# EasyEDA Pro project ProPrj_Solar MPPT Charger_2024-10-06.epro

# Schematic Solar Converter
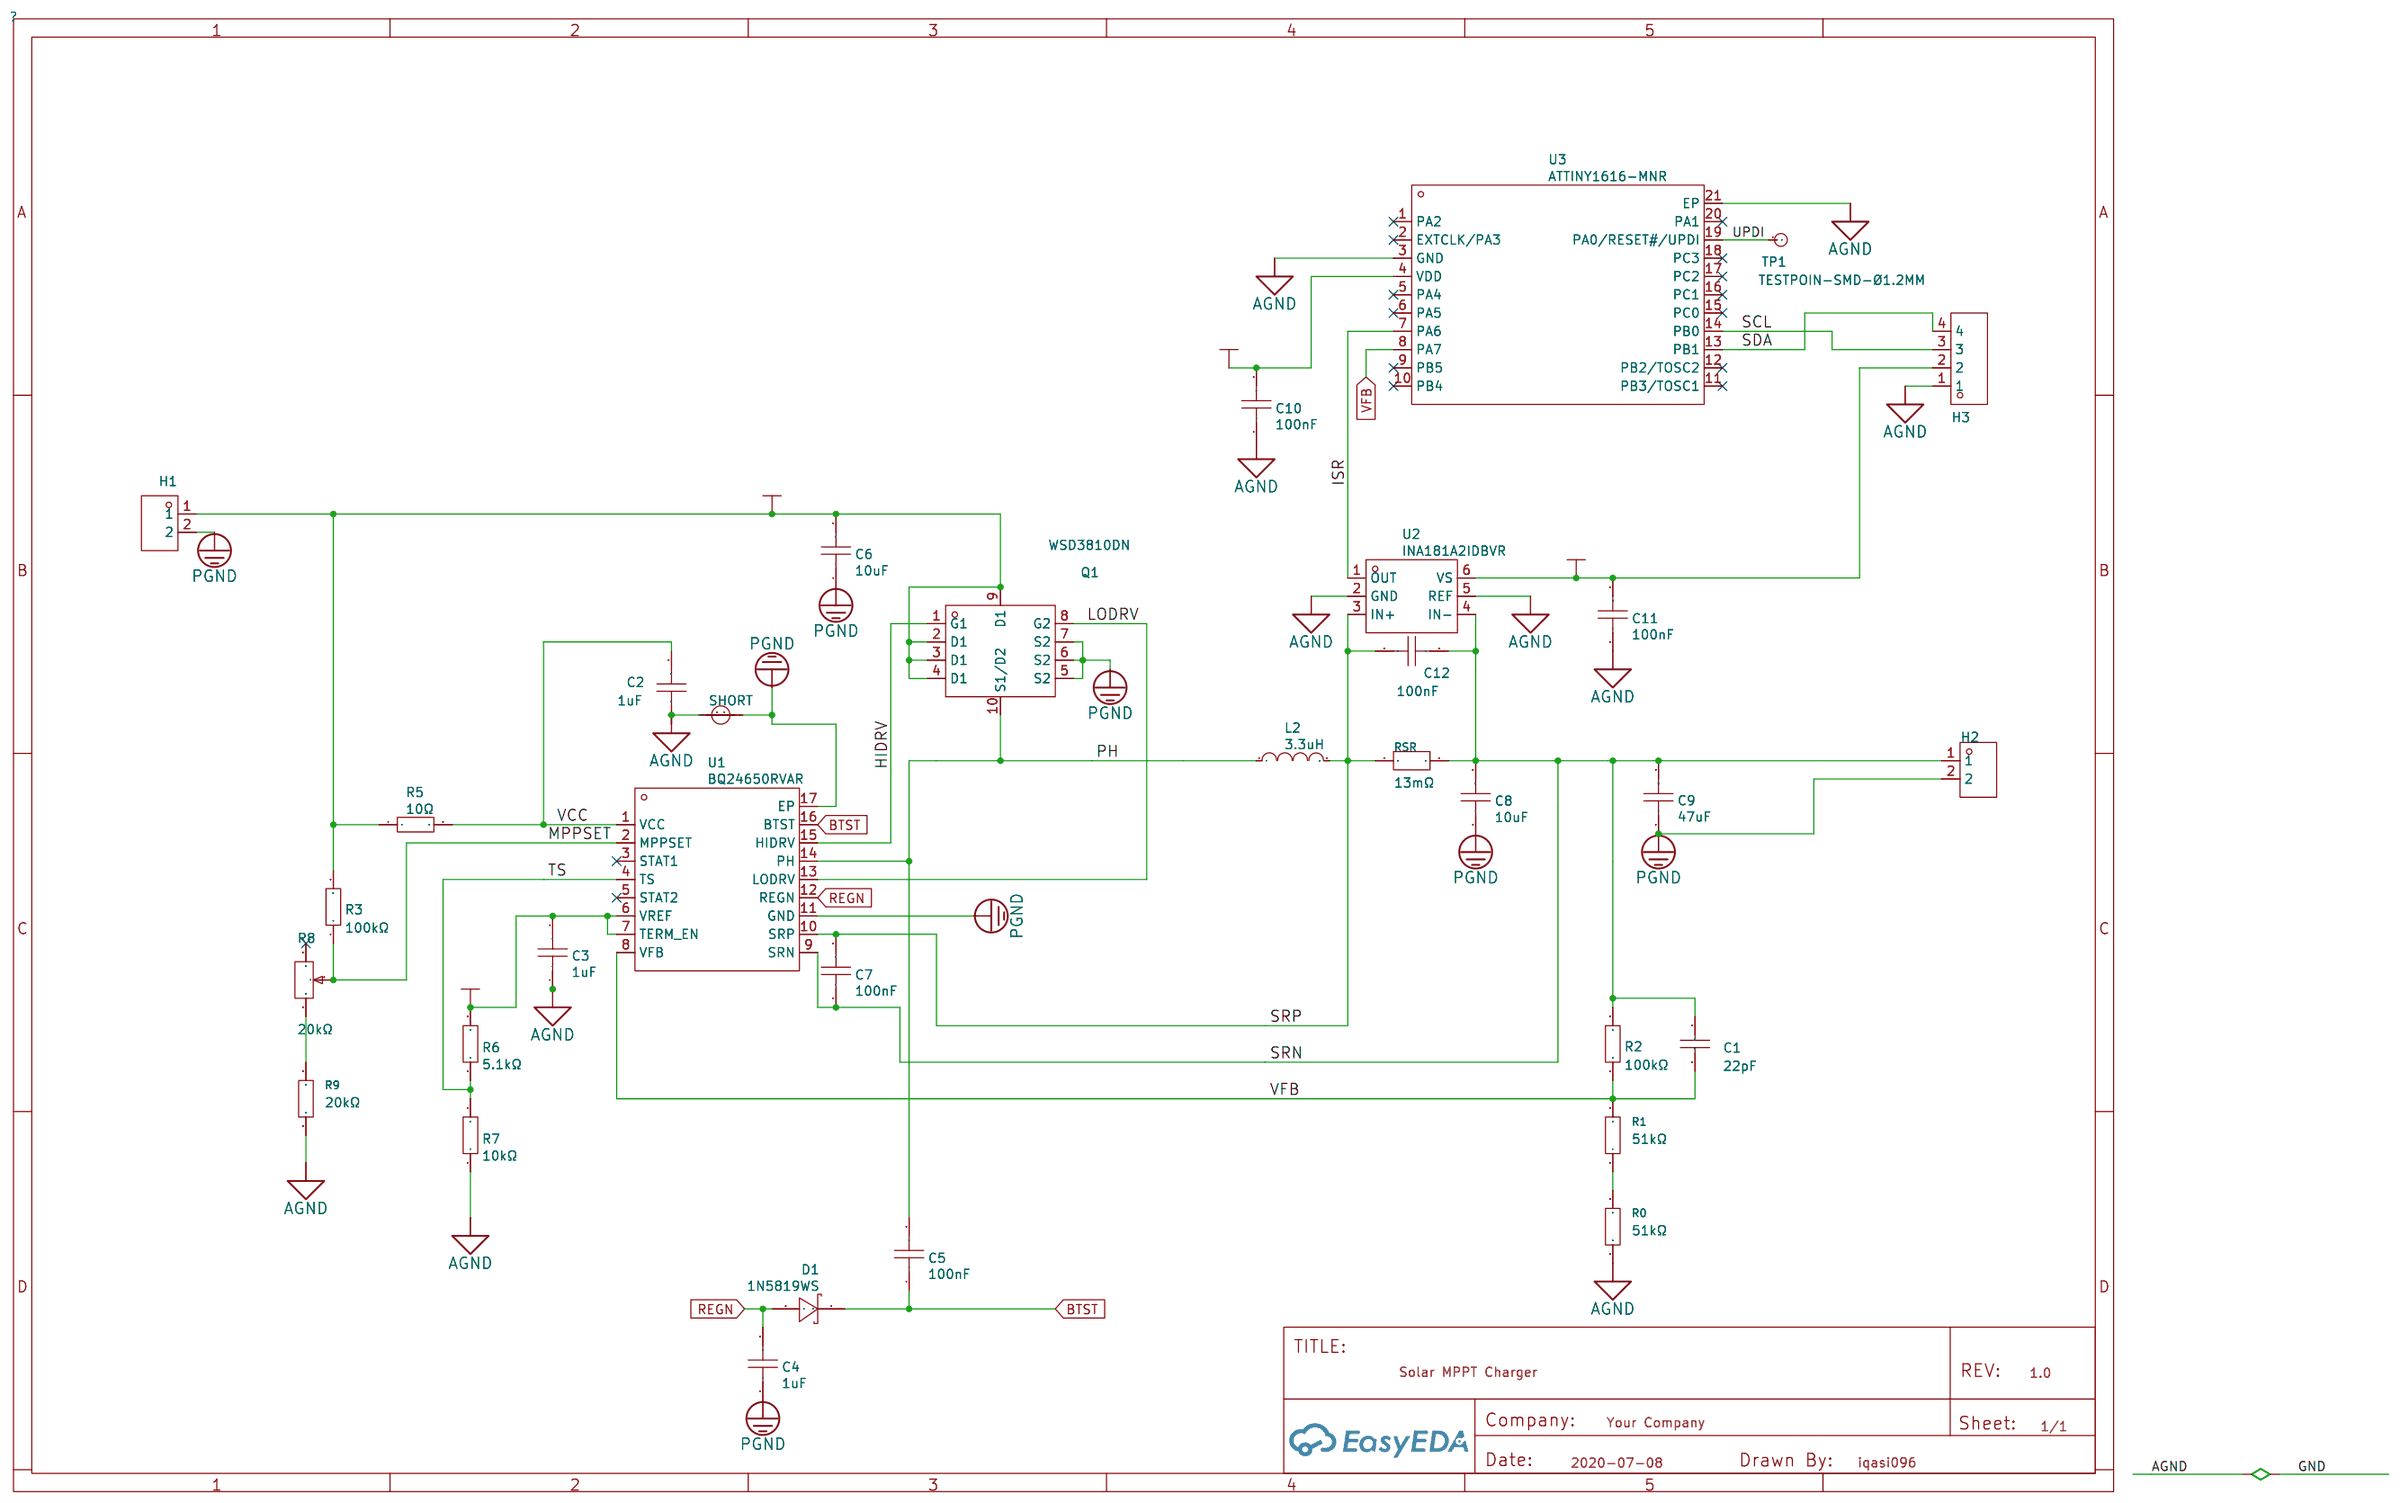
[diagram p0: schematic sheet]

## Parts
C1  22pF  [C0402]
C2  1uF  [C0402]
C3  1uF  [C0402]
C4  1uF  [C0402]
C5  100nF  [C0402]
C6  10uF  [C0603]
C7  100nF  [C0402]
C8  10uF  [C0603]
C9  47uF  [C1206]
C10  100nF  [C0402]
C11  100nF  [C0402]
C12  100nF  [C0402]
D1  1N5819WS  [SOD-323_L1.8-W1.3-LS2.5-RD]
H1  SIP2-2.54MM双排针  [footprint_31f8]
H2  SIP2-2.54MM双排针  [footprint_31f8]
H3  22284040  [footprint_b63e]
L2  3.3uH  [IND-SMD_L7.1-W6.6]
Q1  WSD3810DN  [DFN-8_L3.0-W3.0-P0.65-BL_WSD3810DN]
R0  51kΩ  [R0402]
R1  51kΩ  [R0402]
R2  100kΩ  [R0402]
R3  100kΩ  [R0402]
R5  10Ω  [R0402]
R6  5.1kΩ  [R0402]
R7  10kΩ  [R0402]
R8  20kΩ  [RES-ADJ-SMD_3P-L3.8-W3.0-P2.00-BL-FS]
R9  20kΩ  [R0402]
RSR  13mΩ  [R0805]
SHORT  -  [short_keith]  (no BOM)
TP1  TESTPOIN-SMD-Ø1.2MM  [footprint_b741]
U1  BQ24650RVAR  [footprint_acdf]
U2  INA181A2IDBVR  [SOT-23-6_L2.9-W1.6-P0.95-LS2.8-BL]
U3  ATTINY1616-MNR  [footprint_6c4b]

## Library data of the parts
C1 = 0402CG220J500NT: Capacitance: Tolerance:±5% Tolerance:±5% Voltage Rated: Temperature Coefficient:; LCSC Part Name: 22pF ±5% 50V; Supplier Part: C1555; Manufacturer: FH(风华); Supplier Footprint: 0402; JLCPCB Part Class: Basic Part; Datasheet: https://atta.szlcsc.com/upload/public/pdf/source/20200305/C486355_26A10D38EF8C2A5C37091D0039909270.pdf; Supplier: LCSC; Tolerance: ±5%
C2-C4 = CL05A105KA5NQNC: Capacitance: Tolerance:±10% Tolerance:±10% Voltage Rated: Temperature Coefficient:; LCSC Part Name: 1uF ±10% 25V; Supplier Part: C52923; Manufacturer: SAMSUNG(三星); Supplier Footprint: 0402; JLCPCB Part Class: Basic Part; Datasheet: https://atta.szlcsc.com/upload/public/pdf/source/20160218/1457707763339.pdf; Supplier: LCSC; Tolerance: ±10%
C5 C7 C10-C12 = CL05B104KB54PNC: Capacitance: Tolerance:±10% Tolerance:±10% Voltage Rated: Temperature Coefficient:; LCSC Part Name: 100nF ±10% 50V; Supplier Part: C307331; Manufacturer: SAMSUNG(三星); Supplier Footprint: 0402; JLCPCB Part Class: Basic Part; Datasheet: https://atta.szlcsc.com/upload/public/pdf/source/20160218/1457707763339.pdf; Supplier: LCSC; Tolerance: ±10%
C6 C8 = CL10A106MA8NRNC: Capacitance: Tolerance:±20% Tolerance:±20% Voltage Rated: Temperature Coefficient:; LCSC Part Name: 10uF ±20% 25V; Supplier Part: C96446; Manufacturer: SAMSUNG(三星); Supplier Footprint: 0603; JLCPCB Part Class: Basic Part; Datasheet: https://atta.szlcsc.com/upload/public/pdf/source/20160218/1457707763339.pdf; Supplier: LCSC; Tolerance: ±20%
C9 = CL31A476MPHNNNE: Capacitance: Tolerance:±20% Tolerance:±20% Voltage Rated: Temperature Coefficient:; LCSC Part Name: 47uF ±20% 10V; Supplier Part: C96123; Manufacturer: SAMSUNG(三星); Supplier Footprint: 1206; JLCPCB Part Class: Basic Part; Datasheet: https://atta.szlcsc.com/upload/public/pdf/source/20160218/1457707763339.pdf; Supplier: LCSC; Tolerance: ±20%
D1 = 1N5819WS_C191023: Forward Voltage (Vf@If):600mV@1A Reverse Voltage (Vr):40V Average Rectified Current (Io):1A; LCSC Part Name: 电压:40V 电流:1A; Supplier Part: C191023; Manufacturer: Hottech(合科泰); Supplier Footprint: SOD-323; JLCPCB Part Class: Basic Part; Datasheet: https://atta.szlcsc.com/upload/public/pdf/source/20220428/3CB86FD8D28D653594B4E35F9D5AEFD9.pdf; Supplier: LCSC; Forward Voltage (Vf@If): 600mV@1A; Reverse Voltage (Vr): 40V; Average Rectified Current (Io): 1A
H1 H2 = SIP2-2.54MM双排针: Supplier: LCSC; Supplier Part: C9900003705; Manufacturer: null; Manufacturer Part: SIP2-2.54mm双排针; JLCPCB Part Class: Extended Part
H3 = 22284040: Supplier: LCSC; Supplier Part: C587039; Manufacturer: MOLEX; JLCPCB Part Class: Extended Part
L2 = CMLO0650H3R3MTT: Inductance: Tolerance:±20% Tolerance:±20% Rated Current: DC Resistance (DCR): Type:屏蔽电感; LCSC Part Name: 3.3uH ±20%; Supplier Part: C439008; Manufacturer: Cybermax(思博科技); Supplier Footprint: SMD,7.1x6.6mm; JLCPCB Part Class: Extended Part; Datasheet: https://atta.szlcsc.com/upload/public/pdf/source/20191016/C439014_8EB8B87E5A293C2FB057F0008DFF1D19.pdf; Supplier: LCSC; Tolerance: ±20%; Type: 屏蔽电感
Q1 = WSD3810DN: Type:2 N-Channel Drain Source Voltage (Vdss): Continuous Drain Current (Id): Power Dissipation (Pd): Drain Source On Resistance (RDS(on)@Vgs,Id):9mΩ@10V,10A Gate Threshold Voltage (Vgs(th)@Id):1.6V@250uA Total Gate Charge (Qg@Vgs):8nC@10V Input Capacitanc; LCSC Part Name: 2个N沟道 耐压:30V 电流:18A; Supplier Part: C2758409; Manufacturer: WINSOK(微硕); Supplier Footprint: DFN-8(3x3); JLCPCB Part Class: Extended Part; Datasheet: https://atta.szlcsc.com/upload/public/pdf/source/20210312/C2758409_38394AEA5B26017FED03245C33F41575.pdf; Supplier: LCSC; Type: 2 N-Channel; Drain Source On Resistance (RDS(on)@Vgs,Id): 9mΩ@10V,10A; Gate Threshold Voltage (Vgs(th)@Id): 1.6V@250uA; Total Gate Charge (Qg@Vgs): 8nC@10V; Input Capacitance (Ciss@Vds): 455pF@15V; Reverse Transfer Capacitance (Crss@Vds): 22pF@15V; Operating Temperature: -55℃~+150℃@(Tj)
R0 R1 = 0402WGF5102TCE: Type:Thick Film Resistors Resistance:51kΩ Tolerance:±1% Tolerance:±1% Power(Watts): Overload Voltage (Max): Temperature Coefficient:±100ppm/℃ Temperature Coefficient:±100ppm/℃ Operating Temperature Range:-55℃~+155℃ Operating Temperature Range:-55℃~+155℃; LCSC Part Name: 51kΩ ±1% 62.5mW 厚膜电阻; Supplier Part: C25794; Manufacturer: UNI-ROYAL(厚声); Supplier Footprint: 0402; Datasheet: https://atta.szlcsc.com/upload/public/pdf/source/20200306/C422600_1E6D84923E4A46A82E41ADD87F860B5C.pdf; Supplier: LCSC; Type: Thick Film Resistors; Tolerance: ±1%; Temperature Coefficient: ±100ppm/℃; Operating Temperature Range: -55℃~+155℃
R2 R3 = 0402WGF1003TCE: Type:Thick Film Resistors Resistance:100kΩ Tolerance:±1% Tolerance:±1% Power(Watts): Overload Voltage (Max): Temperature Coefficient:±100ppm/℃ Temperature Coefficient:±100ppm/℃ Operating Temperature Range:-55℃~+155℃ Operating Temperature Range:-55℃~+155℃; LCSC Part Name: 100kΩ ±1% 62.5mW 厚膜电阻; Supplier Part: C25741; Manufacturer: UNI-ROYAL(厚声); Supplier Footprint: 0402; JLCPCB Part Class: Basic Part; Datasheet: https://atta.szlcsc.com/upload/public/pdf/source/20200306/C422600_1E6D84923E4A46A82E41ADD87F860B5C.pdf; Supplier: LCSC; Type: Thick Film Resistors; Tolerance: ±1%; Temperature Coefficient: ±100ppm/℃; Operating Temperature Range: -55℃~+155℃
R5 = 0402WGF100JTCE: Type:Thick Film Resistors Resistance:10Ω Tolerance:±1% Tolerance:±1% Power(Watts): Overload Voltage (Max): Temperature Coefficient:±200ppm/℃ Temperature Coefficient:±200ppm/℃ Operating Temperature Range:-55℃~+155℃ Operating Temperature Range:-55℃~+155℃; LCSC Part Name: 10Ω ±1% 62.5mW 厚膜电阻; Supplier Part: C25077; Manufacturer: UNI-ROYAL(厚声); Supplier Footprint: 0402; JLCPCB Part Class: Basic Part; Datasheet: https://atta.szlcsc.com/upload/public/pdf/source/20200306/C422600_1E6D84923E4A46A82E41ADD87F860B5C.pdf; Supplier: LCSC; Type: Thick Film Resistors; Tolerance: ±1%; Temperature Coefficient: ±200ppm/℃; Operating Temperature Range: -55℃~+155℃
R6 = 0402WGF5101TCE: Type:Thick Film Resistors Resistance:5.1kΩ Tolerance:±1% Tolerance:±1% Power(Watts): Overload Voltage (Max): Temperature Coefficient:±100ppm/℃ Temperature Coefficient:±100ppm/℃ Operating Temperature Range:-55℃~+155℃ Operating Temperature Range:-55℃~+155℃; LCSC Part Name: 5.1kΩ ±1% 62.5mW 厚膜电阻; Supplier Part: C25905; Manufacturer: UNI-ROYAL(厚声); Supplier Footprint: 0402; JLCPCB Part Class: Basic Part; Datasheet: https://atta.szlcsc.com/upload/public/pdf/source/20200306/C422600_1E6D84923E4A46A82E41ADD87F860B5C.pdf; Supplier: LCSC; Type: Thick Film Resistors; Tolerance: ±1%; Temperature Coefficient: ±100ppm/℃; Operating Temperature Range: -55℃~+155℃
R7 = 0402WGF1002TCE: Type:Thick Film Resistors Resistance:10kΩ Tolerance:±1% Tolerance:±1% Power(Watts): Overload Voltage (Max): Temperature Coefficient:±100ppm/℃ Temperature Coefficient:±100ppm/℃ Operating Temperature Range:-55℃~+155℃ Operating Temperature Range:-55℃~+155℃; LCSC Part Name: 10kΩ ±1% 62.5mW 厚膜电阻; Supplier Part: C25744; Manufacturer: UNI-ROYAL(厚声); Supplier Footprint: 0402; JLCPCB Part Class: Basic Part; Datasheet: https://atta.szlcsc.com/upload/public/pdf/source/20200306/C422600_1E6D84923E4A46A82E41ADD87F860B5C.pdf; Supplier: LCSC; Type: Thick Film Resistors; Tolerance: ±1%; Temperature Coefficient: ±100ppm/℃; Operating Temperature Range: -55℃~+155℃
R8 = VG039NCHXTB203: Resistance: Tolerance:±25% Tolerance:±25%; LCSC Part Name: 20kΩ ±25%; Supplier Part: C128550; Manufacturer: HDK(北陆电气); Supplier Footprint: SMD; JLCPCB Part Class: Extended Part; Datasheet: https://atta.szlcsc.com/upload/public/pdf/source/20171123/C145162_15114111014461137838.pdf; Supplier: LCSC; Tolerance: ±25%
R9 = 0402WGF2002TCE: Type:Thick Film Resistors Resistance:20kΩ Tolerance:±1% Tolerance:±1% Power(Watts): Overload Voltage (Max): Temperature Coefficient:±100ppm/℃ Temperature Coefficient:±100ppm/℃ Operating Temperature Range:-55℃~+155℃ Operating Temperature Range:-55℃~+155℃; LCSC Part Name: 20kΩ ±1% 62.5mW 厚膜电阻; Supplier Part: C25765; Manufacturer: UNI-ROYAL(厚声); Supplier Footprint: 0402; JLCPCB Part Class: Basic Part; Datasheet: https://atta.szlcsc.com/upload/public/pdf/source/20200306/C422600_1E6D84923E4A46A82E41ADD87F860B5C.pdf; Supplier: LCSC; Type: Thick Film Resistors; Tolerance: ±1%; Temperature Coefficient: ±100ppm/℃; Operating Temperature Range: -55℃~+155℃
RSR = CS05W4F130MT5E: Type:Thick Film Resistors Resistance:13mΩ Tolerance:±1% Tolerance:±1% Power(Watts): Overload Voltage (Max): Operating Temperature Range:-55℃~+155℃ Operating Temperature Range:-55℃~+155℃; LCSC Part Name: 13mΩ ±1% 250mW 厚膜电阻; Supplier Part: C473577; Manufacturer: UNI-ROYAL(厚声); Supplier Footprint: 0805; Datasheet: https://atta.szlcsc.com/upload/public/pdf/source/20191223/C473046_681CF5EDF1CF97C0CF80B711D8BC42E2.pdf; Supplier: LCSC; Type: Thick Film Resistors; Tolerance: ±1%; Operating Temperature Range: -55℃~+155℃
SHORT = short_small
TP1 = TESTPOIN-SMD-Ø1.2MM
U1 = BQ24650RVAR: Supplier Part: C53712; Manufacturer: TI(德州仪器); Supplier Footprint: VQFN-16-EP(3.6x3.6); JLCPCB Part Class: Extended Part; Datasheet: https://www.ti.com/cn/lit/gpn/bq24650; Supplier: LCSC
U2 = INA181A2IDBVR: Number of Channels:单路 Supply Current:260uA Operating Temperature:-40℃~+125℃ Operating Temperature:-40℃~+125℃; Supplier Part: C2058784; Manufacturer: TI(德州仪器); Supplier Footprint: SOT-23-6; JLCPCB Part Class: Extended Part; Datasheet: https://www.ti.com/cn/lit/gpn/ina2181; Supplier: LCSC; Number of Channels: 单路; Supply Current: 260uA; Operating Temperature: -40℃~+125℃
U3 = ATTINY1616-MNR: CPU Core:AVR Program Storage Size:16KB RAM Size:2KB GPIO Ports Number:18 Operating Voltage Range:1.8V~5.5V Operating Voltage Range:1.8V~5.5V CPU Maximum Speed:20MHz Program Memory Type:FLASH Operating Temperature Range:-40℃~+105℃ Operating Temperature Ran; Supplier Part: C507118; Manufacturer: MICROCHIP(美国微芯); Supplier Footprint: QFN-20-EP(3x3); JLCPCB Part Class: Extended Part; Datasheet: https://atta.szlcsc.com/upload/public/pdf/source/20200402/C507118_C9B3D13493A25E1DA778A35EE1D23665.pdf; Supplier: LCSC; CPU Core: AVR; Program Storage Size: 16KB; RAM Size: 2KB; GPIO Ports Number: 18; Operating Voltage Range: 1.8V~5.5V; CPU Maximum Speed: 20MHz; Program Memory Type: FLASH; Operating Temperature Range: -40℃~+105℃; ADC (Bit): 10bit; DAC (Bit): 8bit; Peripheral/Function: WDT；PWM; Watchdog: 有; Infrared Data Association: 有; Low-Voltage Detect: 有; Internal Oscillator: 有

## Nets
AGND: C2.1 C3.1 C10.1 C11.1 H3.1 R0.1 R7.1 R9.1 SHORT.1 U2.2(GND) U2.5(REF) U3.3(GND) U3.21(EP)
PGND: C4.1 C6.1 C8.1 C9.1 H1.2 H2.2 Q1.5(S2) Q1.6(S2) Q1.7(S2) SHORT.2 U1.11(GND) U1.17(EP)
VCC: C2.2 R5.2 U1.1(VCC)
VDD: C3.2 C10.2 C11.2 H3.2 R6.2 U1.6(VREF) U1.7(TERM_EN) U2.6(VS) U3.4(VDD)
VIN: C6.2 H1.1 Q1.2(D1) Q1.3(D1) Q1.4(D1) Q1.9(D1) R3.2 R5.1
BTST: C5.1 D1.1(K) U1.16(BTST)
HIDRV: Q1.1(G1) U1.15(HIDRV)
ISR: U2.1(OUT) U3.7(PA6)
LODRV: Q1.8(G2) U1.13(LODRV)
MPPSET: R3.1 R8.2 U1.2(MPPSET)
PH: C5.2 L2.1 Q1.10(S1/D2) U1.14(PH)
REGN: C4.2 D1.2(A) U1.12(REGN)
SCL: H3.3 U3.14(PB0)
SDA: H3.4 U3.13(PB1)
SRN: C1.2 C7.1 C8.2 C9.2 C12.2 H2.1 R2.2 RSR.2 U1.9(SRN) U2.4(IN-)
SRP: C7.2 C12.1 L2.2 RSR.1 U1.10(SRP) U2.3(IN+)
TS: R6.1 R7.2 U1.4(TS)
UPDI: TP1.1 U3.19(PA0/RESET#/UPDI)
VFB: C1.1 R1.2 R2.1 U1.8(VFB) U3.8(PA7)
$1N1372: R8.1 R9.2
$1N5877: R0.2 R1.1

Not connected (* = marked no-connect by the designer): R8 3*; U1 3(STAT1)* 5(STAT2)*; U3 1(PA2)* 2(EXTCLK/PA3)* 5(PA4)* 6(PA5)* 9(PB5)* 10(PB4)* 11(PB3/TOSC1)* 12(PB2/TOSC2)* 15(PC0)* 16(PC1)* 17(PC2)* 18(PC3)* 20(PA1)*

# Board Solar Converter
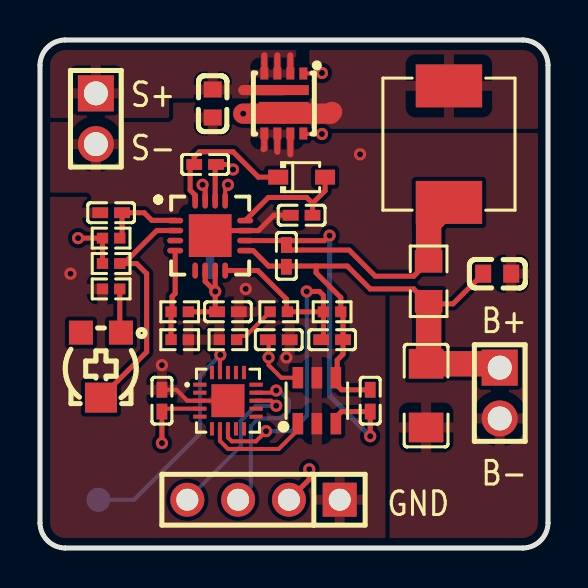
[diagram p1: board, top side]
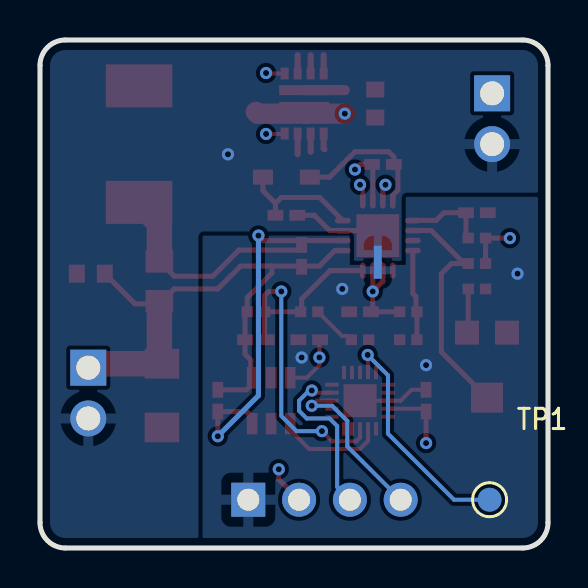
[diagram p2: board, bottom side, seen from below]

Outline 25.4 x 25.4 mm; copper layers: Top Layer, Inner1, Inner2, Bottom Layer. Coordinates in mm from the lower left corner of the outline.
Outline path: 0,24.13 arc(0.37,25.03) 1.27,25.4 24.13,25.4 arc(25.03,25.03) 25.4,24.13 25.4,1.27 arc(25.03,0.37) 24.13,0 1.27,0 arc(0.37,0.37) 0,1.27 0,24.13
Stack: Top Layer 0.035mm 外层铜厚1oz / Dielectric1 0.28mm 7628 RC49% 8.6mil / Inner1 0.035mm 内层铜厚 / Dielectric2 0.28mm 1.1mm H/HOZ 含铜 / Inner2 0.035mm 内层铜厚 / Dielectric3 0.28mm 7628 RC49% 8.6mil / Bottom Layer 0.035mm 外层铜厚1oz

## Design rules (mm)
template: User Custom Config
spacing Default (default): track to track 0.152, other pairs 0 to 0.152
spacing Slim: track to track 0.152, other pairs 0 to 0.152
track width Default (default): min 0.127, default 0.127, max 25.4
track width Slim: min 0.127, default 0.127, max 25.4
differential pair differentialPair (default): width min 0.127, default 0.254, max 2.54; gap min 0.152, default 0.152
via Default (default): diameter min 0.305, default 0.305, max 100.025; hole min 0.152, default 0.152, max 59.995
via Slim: diameter min 0.305, default 0.305, max 100.025; hole min 0.152, default 0.152, max 59.995

## Placement (name value [footprint] x y rotation side)
C1  22pF  [C0402]  14.61 10.41 0 top
C2  1uF  [C0402]  3.56 16.76 0 top
C3  1uF  [C0402]  9.4 11.81 180 top
C4  1uF  [C0402]  13.08 16.64 0 top
C5  100nF  [C0402]  8.25 19.18 0 top
C6  10uF  [C0603]  8.64 22.22 90 top
C7  100nF  [C0402]  12.32 14.61 90 top
C8  10uF  [C0603]  22.86 13.72 180 top
C9  47uF  [C1206]  19.3 7.62 90 top
C10  100nF  [C0402]  6.1 7.37 270 top
C11  100nF  [C0402]  11.94 10.41 180 top
C12  100nF  [C0402]  16.51 7.37 90 top
D1  1N5819WS  [SOD-323_L1.8-W1.3-LS2.5-RD]  13.08 18.54 0 top
H1  SIP2-2.54MM双排针  [footprint_31f8]  2.79 21.46 180 top
H2  SIP2-2.54MM双排针  [footprint_31f8]  22.99 7.75 180 top
H3  22284040  [footprint_b63e]  11.18 2.41 180 top
L2  3.3uH  [IND-SMD_L7.1-W6.6]  20.45 20.19 270 top
Q1  WSD3810DN  [DFN-8_L3.0-W3.0-P0.65-BL_WSD3810DN]  12.19 22.22 180 top
R0  51kΩ  [R0402]  9.4 10.41 0 top
R1  51kΩ  [R0402]  11.94 11.81 0 top
R2  100kΩ  [R0402]  14.61 11.81 0 top
R3  100kΩ  [R0402]  3.56 14.22 180 top
R5  10Ω  [R0402]  3.56 15.49 0 top
R6  5.1kΩ  [R0402]  6.99 11.81 0 top
R7  10kΩ  [R0402]  6.99 10.41 180 top
R8  20kΩ  [RES-ADJ-SMD_3P-L3.8-W3.0-P2.00-BL-FS]  3.05 9.14 180 top
R9  20kΩ  [R0402]  3.56 12.95 0 top
RSR  13mΩ  [R0805]  19.43 13.33 270 top
SHORT  -  [short_keith]  8.51 14.29 90 bottom
TP1  TESTPOIN-SMD-Ø1.2MM  [footprint_b741]  2.92 2.41 180 bottom
U1  BQ24650RVAR  [footprint_acdf]  8.51 15.62 270 top
U2  INA181A2IDBVR  [SOT-23-6_L2.9-W1.6-P0.95-LS2.8-BL]  13.84 7.37 0 top
U3  ATTINY1616-MNR  [footprint_6c4b]  9.4 7.37 270 top

## Footprints (pads in the part's own frame, mm; a bottom-side part is the same pattern mirrored in y, then rotated)
C0402
  rect 0.79x0.54 smd: 1(-0.545,0) 2(0.545,0)
C0603
  rect 0.8x0.9 smd: 1(-0.7,0) 2(0.7,0)
C1206
  rect 1.485x1.728 smd: 1(-1.593,0) 2(1.593,0)
DFN-8_L3.0-W3.0-P0.65-BL_WSD3810DN
  rect 0.4x0.6 smd: 1(-0.975,-1.5) 2(-0.325,-1.5) 3(0.325,-1.5) 4(0.975,-1.5) 5(0.975,1.5) 6(0.325,1.5) 7(-0.325,1.5) 8(-0.975,1.5)
  rect 2.5x0.5 smd: 9(0,-0.67)
  rect 2.5x1 smd: 10(0,0.42)
footprint_6c4b
  rect 0.2x0.665 smd: 1(-0.8,-1.407) 2(-0.4,-1.407) 3(0,-1.407) 4(0.4,-1.407) 5(0.8,-1.407) 11(0.8,1.407) 12(0.4,1.407) 13(0,1.407) 14(-0.4,1.407) 15(-0.8,1.407)
  rect 0.665x0.2 smd: 6(1.407,-0.8) 7(1.407,-0.4) 8(1.407,0) 9(1.407,0.4) 10(1.407,0.8) 16(-1.407,0.8) 17(-1.407,0.4) 18(-1.407,0) 19(-1.407,-0.4) 20(-1.407,-0.8)
  rect 1.65x1.65 smd: 21(0,0)
footprint_31f8
  rect 1.8x1.8 hole 1.2: 1(0,-1.27)
  round 1.8 hole 1.2: 2(0,1.27)
footprint_acdf
  oval 0.28x0.8 smd: 1(-0.75,-1.75) 2(-0.25,-1.75) 3(0.25,-1.75) 4(0.75,-1.75) 9(0.75,1.75) 10(0.25,1.75) 11(-0.25,1.75) 12(-0.75,1.75)
  oval 0.8x0.28 smd: 5(1.75,-0.75) 6(1.75,-0.25) 7(1.75,0.25) 8(1.75,0.75) 13(-1.75,0.75) 14(-1.75,0.25) 15(-1.75,-0.25) 16(-1.75,-0.75)
  rect 2.14x2.14 smd: 17(0,0)
footprint_b63e
  rect 1.7x1.7 hole 1.1: 1(-3.81,0)
  round 1.7 hole 1.1: 2(-1.27,0) 3(1.27,0) 4(3.81,0)
footprint_b741
  round 1.2 smd: 1(0,0)
IND-SMD_L7.1-W6.6
  rect 2.15x3.32 smd: 1(-2.913,0) 2(2.913,0)
R0402
  rect 0.566x0.54 smd: 1(-0.433,0) 2(0.433,0)
R0805
  rect 1.133x1.377 smd: 1(-1,0) 2(1,0)
RES-ADJ-SMD_3P-L3.8-W3.0-P2.00-BL-FS
  rect 1.2x1.2 smd: 1(-1,-1.625) 3(1,-1.625)
  rect 1.6x1.5 smd: 2(0,1.625)
short_keith
  rect 0.85x0.4 smd: 1(-0.4,0) 2(0.4,0)
SOD-323_L1.8-W1.3-LS2.5-RD
  rect 1x0.75 smd: 1(-1.173,0) 2(1.173,0)
SOT-23-6_L2.9-W1.6-P0.95-LS2.8-BL
  rect 0.532x1.072 smd: 1(-0.95,-1.149) 2(0,-1.149) 3(0.95,-1.149) 4(0.95,1.149) 5(0,1.149) 6(-0.95,1.149)

## Nets
As in the schematic.

Pads without a net: R8 3; U1 3 5; U3 1 2 5 6 9 10 11 12 15 16 17 18 20

## Via types
v1: diameter 0.61, hole 0.305, Top Layer to Bottom Layer, 23 vias

## Routing (per net, layer and track width the routed paths; a pad name or vN(x,y) marks a point on that pad's centre or on a via; arc(x,y) is an arc through that point)
AGND: length 3.5
  Top Layer w0.203: C10.1 6.82,7.91 7.37,7.37 U3.3 U3.21
  vias: v1(1.52,13.72) v1(6.1,9.14) v1(10.29,12.95) v1(12.32,9.53)
PGND: length 7.2
  Top Layer w0.254: U1.17 8.76,15.87 U1.11 10.92,15.87 11.68,16.64 C4.1
  Top Layer w0.305: Q1.5 11.22,19.98 11.18,19.94 ; Q1.6 11.87,19.81 ; Q1.7 12.52,19.69
  vias: v1(16,19.69)
VCC: length 4.1
  Top Layer w0.254: U1.1 6.75,16.38 5.59,16.38 5.21,16.76 C2.2 4.1,15.61 R5.2
VDD: length 13.3
  Top Layer w0.203: 6.1,6.31 6.1,6.97 U3.4 ; 11.39,10.41 11.43,10.38 v1(11.43,9.53) 11.43,9.14 12.06,8.52 12.89,8.52
  Top Layer w0.254: 8.76,12.83 8.26,13.33 U1.6 ; 8.76,12.83 v1(8.76,12.83) 8.76,11.9 C3.2 R6.2 ; 8.76,12.83 U1.7 ; H3.2 13.46,3.43 v1(13.46,3.94) ; v1(6.1,5.25) 6.1,6.31
VIN: length 10.2
  Top Layer w0.254: v1(1.91,15.49) R5.1 R3.2
  Top Layer w0.305: Q1.4 11.22,24.64 ; Q1.2 12.52,24.64 ; Q1.3 11.87,24.64
  Top Layer w0.508: Q1.9 10.16,22.89
  Inner2 w0.254: v1(1.91,15.49) 1.91,18.42
BTST: length 7.2
  Top Layer w0.254: U1.16 7.76,17.64 7.5,17.89 7.5,18.97 C5.1 7.71,19.56 7.96,19.81 9.65,19.81 10.92,18.54 D1.1
HIDRV: length 11.8
  Top Layer w0.203: v1(14.1,23.75) 14.07,23.72 Q1.1
  Top Layer w0.254: U1.15 8.26,18.03 v1(8.13,18.16)
  Inner1 w0.203: v1(14.1,23.75) 10.8,23.75 8.13,21.08 v1(8.13,18.16)
ISR: length 5.4
  Top Layer w0.203: U3.7 9,5.35 9.4,4.95 11.94,4.95 12.89,5.91 12.89,6.22
LODRV: length 7.5
  Top Layer w0.203: U1.13 9.26,18.02 v1(9.4,18.16) ; Q1.8 13.19,20.7 v1(14.1,20.7)
  Inner1 w0.203: v1(9.4,18.16) 11.56,18.16 v1(14.1,20.7)
MPPSET: length 12
  Top Layer w0.254: U1.2 6.75,15.88 5.84,15.88 4.19,14.22 ; R3.1 4.19,14.22 ; 4.19,14.22 4.83,14.22 5.33,13.72 5.33,9.8 R8.2
PH: length 10.4
  Top Layer w0.254: v1(9.65,18.92) 9.4,19.18 C5.2 8.76,19.14 U1.14
  Top Layer w0.991: 12.1,21.72 Q1.10
  Top Layer w1.016: 14.61,21.8 14.52,21.72 v1(10.16,21.72)
  Inner1 w0.254: v1(9.65,18.92) 9.65,21.21 v1(10.16,21.72)
REGN: length 6.1
  Top Layer w0.254: 13.63,17.23 14.25,17.86 D1.2 ; 13.63,17.23 13.34,17.53 11.41,17.53 U1.12 ; 13.63,17.23 C4.2
SCL: length 8.6
  Top Layer w0.203: U3.14 11.7,7.77 v1(11.81,7.87)
  Bottom Layer w0.203: v1(11.81,7.87) 11.94,7.87 12.45,7.37 12.45,6.86 12.06,6.48 10.92,6.48 10.54,6.1 10.54,3.05 H3.3
SDA: length 8.2
  Top Layer w0.203: U3.13 11.56,7.37 v1(11.81,7.11)
  Bottom Layer w0.203: H3.4 10.03,5.08 10.03,6.35 10.8,7.11 v1(11.81,7.11)
SRN: length 28.4
  Top Layer w0.254: C8.2 20.65,12.21 19.56,12.21 RSR.2 19.3,12.33 18.69,12.95 16.51,12.95 15.37,14.1 13.81,14.1 ; 13.81,14.1 13.81,13.75 15.04,12.52 R2.2 15.15,11.7 C1.2 15.15,9.69 14.86,9.4 14.86,8.58 U2.4 14.79,8.19 15.08,7.91 C12.2 ; 13.81,14.1 12.36,14.1 C7.1 12.28,14.1 11.43,14.1 10.66,14.87 U1.9
  Top Layer w1.27: H2.1 22.79,9.21 C9.2 19.43,9.34 19.43,11.68
SRP: length 29.7
  Top Layer w0.254: C7.2 12.54,15.37 14.22,15.37 v1(14.48,15.62) ; C7.2 12.57,14.9 15.46,14.9 16.76,13.59 18.69,13.59 RSR.1 ; C7.2 12.1,15.37 U1.10 ; v1(16.51,5.59) C12.1 15.08,6.82 14.79,6.54 U2.3
  Top Layer w1.27: L2.2 19.43,16.26 19.43,14.86
  Bottom Layer w0.254: v1(14.48,15.62) 14.48,7.62 v1(16.51,5.59)
TS: length 4.5
  Top Layer w0.254: R7.2 R6.1 6.6,11.86 6.6,12.57 6.76,12.73 U1.4
UPDI: length 11.7
  Top Layer w0.203: U3.19 9,9.63 v1(9.02,9.65)
  Bottom Layer w0.203: v1(9.02,9.65) 8,8.64 8,5.72 4.7,2.41 TP1.1
VFB: length 20.5
  Top Layer w0.203: v1(11.3,5.84) 10.8,5.33 9.59,5.33 9.4,5.52 U3.8
  Top Layer w0.254: U1.8 10.89,13.87 12.32,12.45 12.32,11.86 R1.2 R2.1 ; R2.1 14.17,10.53 C1.1 ; R2.1 14.17,12.62 13.97,12.83 v1(13.34,12.83)
  Bottom Layer w0.203: v1(13.34,12.83) 13.34,6.6 12.57,5.84 v1(11.3,5.84)
$1N1372: length 2.2
  Top Layer w0.254: R9.2 3.99,10.83 R8.1
$1N5877: length 2.3
  Top Layer w0.203: 11.5,11.81 10.29,10.6 10.02,10.6 9.83,10.41

## Copper pours and planes (outline as drawn; the poured copper is in the pictures)
AGND on Top Layer: 0,17.56 7.11,17.56 7.11,14.16 9.91,14.16 9.91,15.62 17.27,15.62 17.27,0 0,0
AGND on Bottom Layer: 0,17.56 7.11,17.56 7.11,14.16 9.91,14.16 9.91,15.62 17.27,15.62 17.27,0 0,0
AGND on Bottom Layer: 0,17.56 7.11,17.56 7.11,14.16 9.91,14.16 9.91,15.62 17.27,15.62 17.27,0 0,0
AGND on Inner1: 0,17.56 7.11,17.56 7.11,14.16 9.91,14.16 9.91,15.62 17.27,15.62 17.27,0 0,0
PGND on Top Layer: 0,25.4 25.4,25.4 25.4,0 0,0
PGND on Bottom Layer: 0,25.4 25.4,25.4 25.4,0 0,0
PGND on Inner1: 0,25.4 25.4,25.4 25.4,0 0,0
VDD on Inner2: 0,17.56 7.11,17.56 7.11,14.16 9.91,14.16 9.91,15.62 17.27,15.62 17.27,0 0,0
VIN on Top Layer: 0,25.4 0,21.5 6.45,21.5 6.45,22.48 12.81,22.48 12.81,25.4
VIN on Inner2: 0,25.4 25.4,25.4 25.4,0 0,0
PH on Top Layer: 13.46,25.4 25.4,25.4 25.4,20.95 13.46,20.95

## Text on the board
Top Silkscreen Layer: S+ | S- | GND | B+ | B-
